# Altium schematic sheet NQX25017A-V1.0(i300-N32WB031).SchDoc
size 580 x 359 mm; SheetNumber: 1; SheetTotal: 1
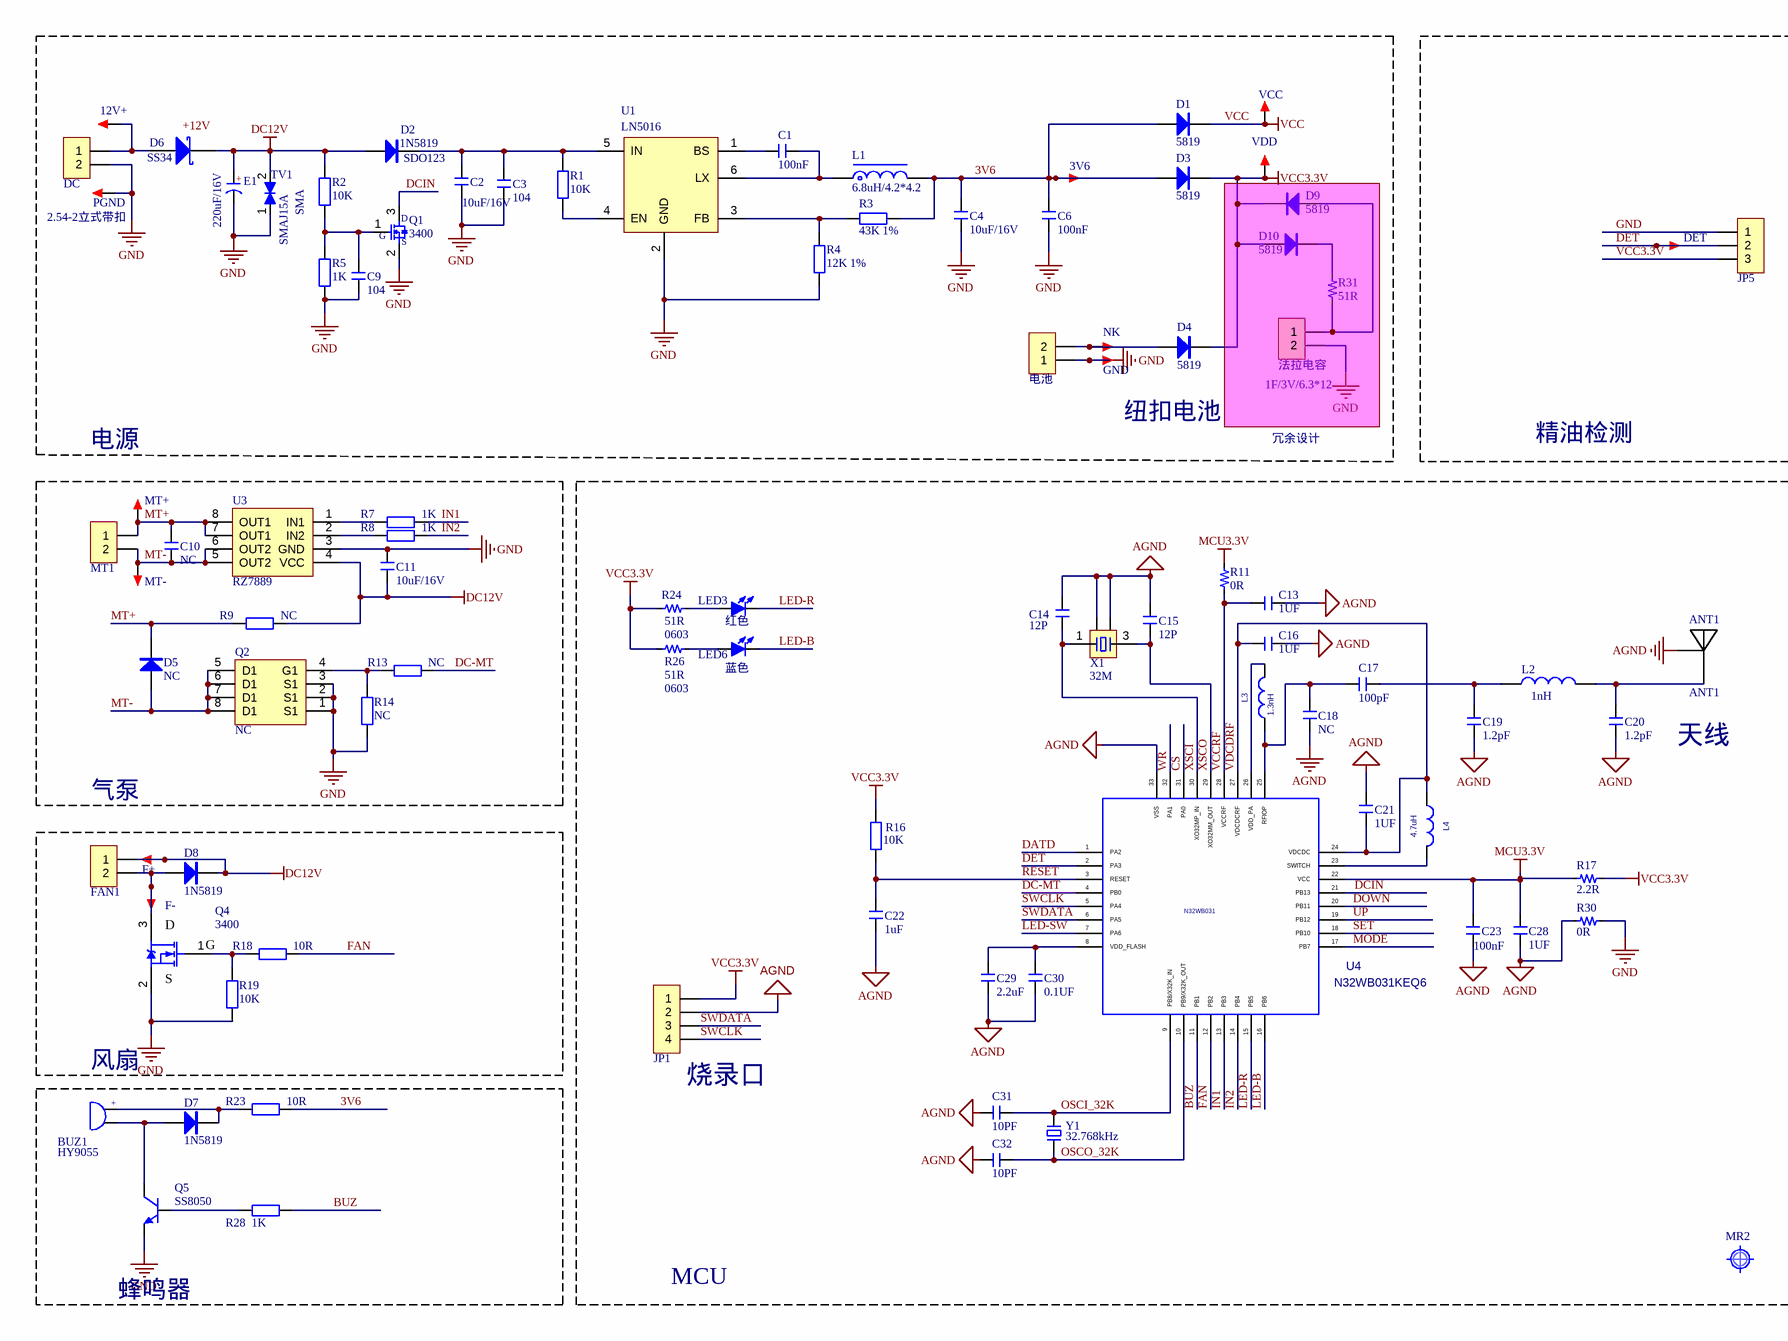
[diagram p0: NQX25017A-V1.0(i300-N32WB031).SchDoc, left]
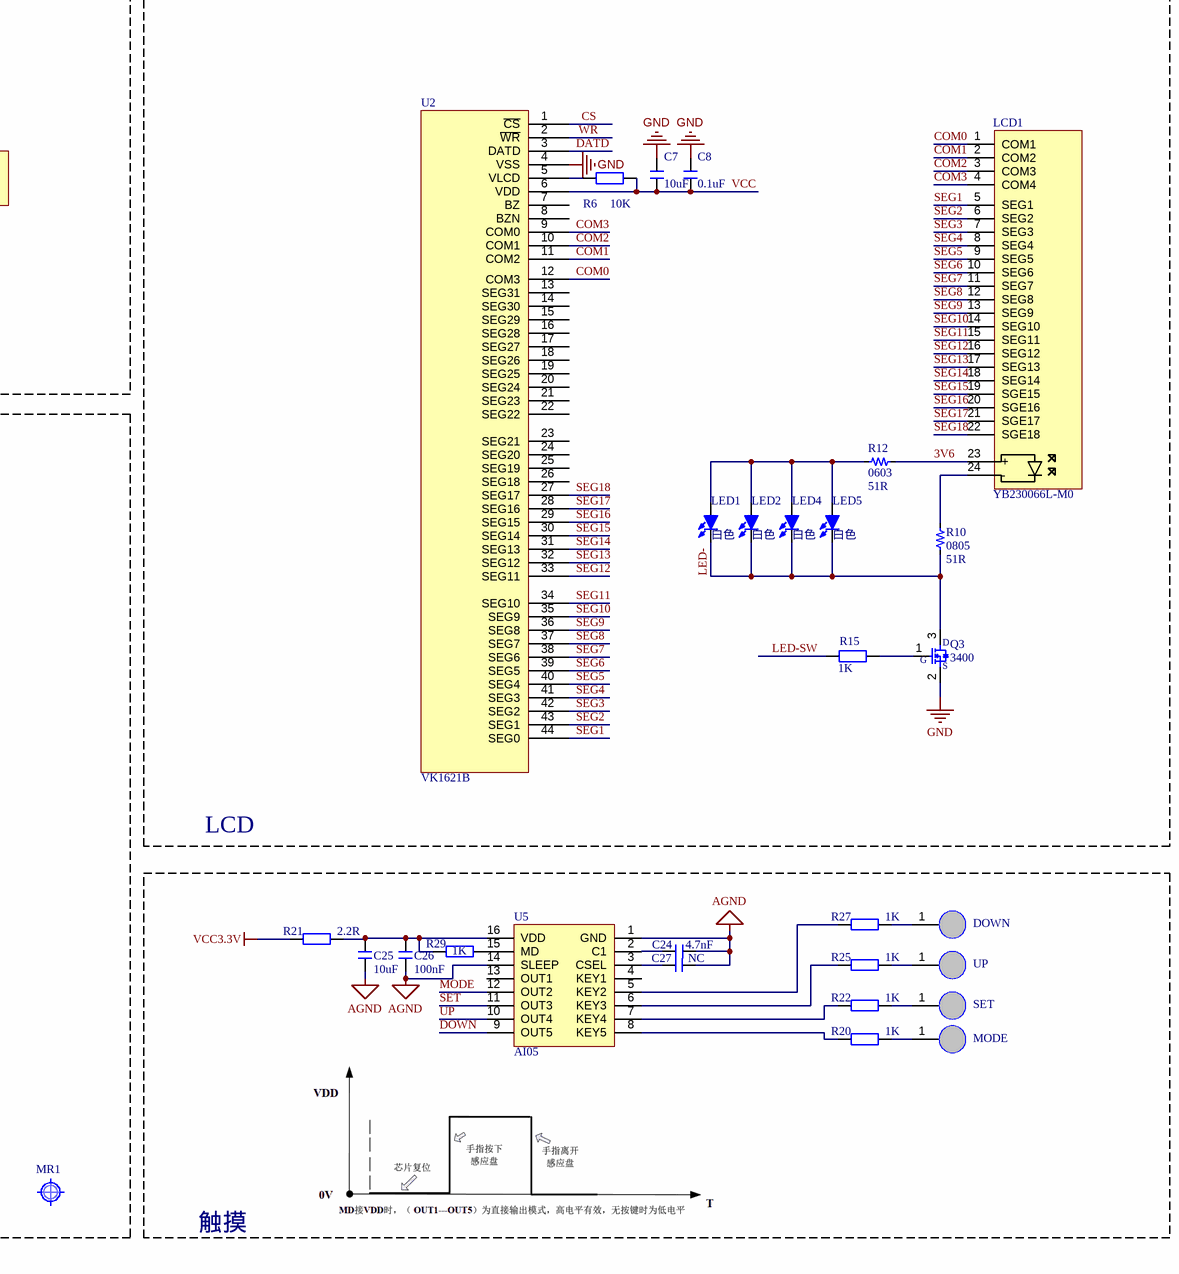
[diagram p1: NQX25017A-V1.0(i300-N32WB031).SchDoc, right]

## Parts
3V6  TEST  [TEST 1.2]  (value not drawn)
12V+  TEST  [TEST 1.2]  (value not drawn)
ANT1  ANT1  [ANT-BLUE]
BUZ1  HY9055  [BEEP 4x9x5.5 - duplicate]
C1  100nF  [C0603-T]
C2  10uF/16V  [C0603]
C3  104  [C0603-T]
C4  10uF/16V  [C0805-T]
C6  100nF  [C0603-T]
C7  10uF  [C0603-T]
C8  0.1uF  [C0603-T]
C9  104  [C0603-T]
C10  NC  [C0603-T]
C11  10uF/16V  [C0603]
C13  1UF  [C0603-T]
C14  12P  [C0603-T]
C15  12P  [C0603-T]
C16  1UF  [C0603-T]
C17  100pF  [C0603-T]
C18  NC  [C0603-T]
C19  1.2pF  [C0603-T]
C20  1.2pF  [C0603-T]
C21  1UF  [C0603-T]
C22  1uF  [C0603-T]
C23  100nF  [C0603-T]
C24  4.7nF  [C0603-T]
C25  10uF  [C0603-T]
C26  100nF  [C0603-T]
C27  NC  [C0603-T]
C28  1UF  [C0603-T]
C29  2.2uF  [C0603-T]
C30  0.1UF  [C0603-T]
C31  10PF  [C0603-T]
C32  10PF  [C0603-T]
D1  5819  [SOD-123]
D2  1N5819  value SDO123  [SOD-123]
D3  5819  [SOD-123]
D4  5819  [SOD-123]
D5  NC  [SMA]
D6  SS34  [SMA]
D7  1N5819  [MINI_MELF (LL34)]
D8  1N5819  [MINI_MELF (LL34)]
D9  5819  [SOD-123]
D10  5819  [SOD-123]
DC  2.54-2立式带扣  [XH2.54-LS-2P]
DET  TEST  [TEST 1.2]  (value not drawn)
DOWN  12x16  [0.3-6.8-12-8]  (value not drawn)
E1  220uF/16V  [CM D(6.3*7.7)]
F+  TEST  [TEST 1.2]  (value not drawn)
F-  TEST  [TEST 1.2]  (value not drawn)
FAN1  2.54-2立式带扣  [XH2.54-LS-2P]  (value not drawn)
GND  TEST  [TEST 1.2]  (value not drawn)
JP1  HDR-1X4  [CN4P2.0]  (value not drawn)
JP5  1.25X3立贴  [MX 1.25-LS-3P]  (value not drawn)
L1  6.8uH/4.2*4.2  [L5X5]
L2  1nH  [R0603-T]
L3  1.3nH  [R0603-T]
L4  4.7uH  [R0603-T]
LCD1  YB230066L-M0  [YB23006L0-M0]
LED1  白色  [LED 0805G]
LED2  白色  [LED 0805G]
LED3  红色  [LED 0805B]
LED4  白色  [LED 0805G]
LED5  白色  [LED 0805G]
LED6  蓝色  [LED 0805B]
MODE  12x16  [0.3-6.8-12-8]  (value not drawn)
MR1  (no value)  [Mark 1]
MR2  (no value)  [Mark 1]
MT1  2.54-2立式带扣  [XH2.54-LS-2P]  (value not drawn)
MT+  TEST  [TEST 1.2]  (value not drawn)
MT-  TEST  [TEST 1.2]  (value not drawn)
NK  TEST  [TEST 1.2]  (value not drawn)
PGND  TEST  [TEST 1.2]  (value not drawn)
Q1  3400  [SOT-23]
Q2  NC  [DFN3X3_8P]
Q3  3400  [SOT-23]
Q4  3400  [SOT-23]
Q5  SS8050  [SOT-23]
R1  10K  [R0603-T]
R2  10K  [R0603-T]
R3  43K 1%  [R0603-T]
R4  12K 1%  [R0603-T]
R5  1K  [R0603-T]
R6  10K  [R0603-T]
R7  1K  [R0603-T]
R8  1K  [R0603-T]
R9  NC  [R1206-T]
R10  51R  value 0805  [R0805-T]
R11  0R  [R0603-T]
R12  51R  value 0603  [R0603-T]
R13  NC  [R0603-T]
R14  NC  [R0603-T]
R15  1K  [R0603-T]
R16  10K  [R0603-T]
R17  2.2R  [R0603-T]
R18  10R  [R0603-T]
R19  10K  [R0603-T]
R20  1K  [R0603-T]
R21  2.2R  [R0603-T]
R22  1K  [R0603-T]
R23  10R  [R0603-T]
R24  51R  value 0603  [R0603-T]
R25  1K  [R0603-T]
R26  51R  value 0603  [R0603-T]
R27  1K  [R0603-T]
R28  1K  [R0603-T]
R29  1K  [R0603-T]
R30  0R  [R0603-T]
R31  51R  [R0805-T]
SET  12x16  [0.3-6.8-12-8]  (value not drawn)
TV1  SMAJ15A  value SMA  [SMA]
U1  LN5016  [SOT23-6L]
U2  VK1621B  [LQFP44 10X10_N]
U3  RZ7889  [SOP8_N]
U4  N32WB031KEQ6  value N32WB031  [QFN32_4X4]
U5  AI05  [SOP16]
UP  12x16  [0.3-6.8-12-8]  (value not drawn)
VCC  TEST  [TEST 1.2]  (value not drawn)
VDD  TEST  [TEST 1.2]  (value not drawn)
X1  32M  [OSC3225]
Y1  32.768kHz  [OSC-3x8-WI-B]
法拉电容  1F/3V/6.3*12  [CE-2.5*5*11-H]
电池  2.0-2立贴无扣  [PH2.0-LS-2P]  (value not drawn)

## Blocks framed on the sheet
精油检测: DET JP5
LCD: C7 C8 LCD1 LED1 LED2 LED4 LED5 Q3 R6 R10 R12 R15 U2
气泵: C10 C11 D5 MT1 MT+ MT- Q2 R7-R9 R13 R14 U3
风扇: D8 F+ F- FAN1 Q4 R18 R19
触摸: C24-C27 DOWN MODE R20-R22 R25 R27 R29 SET U5 UP

## Nets
AGND: ANT1.2 C13.1 C14.2 C15.2 C16.1 C18.1 C19.1 C20.1 C21.1 C22.1 C23.2 C24.2 C25.2 C26.2 C27.2 C28.2 C29.1 C30.2 C31.1 C32.1 JP1.2 R30.2 U4.33(VSS) U5.1(GND) U5.14(SLEEP) X1.2 X1.4
DC12V: C11.1 D2.1(A) D6.2(K) D8.2(K) E1.1(A) F+.1 FAN1.1 R2.1 R9.2 TV1.2(k) U3.4(VCC)
GND: C2.1 C3.1 C4.1 C6.2 C7.1 C8.1 C9.1 C11.2 DC.2 E1.2(K) GND.1 JP5.1 PGND.1 Q1.2(S) Q2.1(S1) Q2.2(S1) Q2.3(S1) Q3.2(S) Q4.2(S) Q5.2(E) R4.1 R5.1 R14.1 R19.1 R30.1 TV1.1(a) U1.2(GND) U2.4(VSS) U3.3(GND) 法拉电容.2 电池.1
MCU3.3V: C23.1 C28.1 R11.2 R17.2 U4.22(VCC)
VCC: C7.2 C8.2 D1.2(K) R6.1 U2.6(VDD) VCC.1
VCC3.3V: D3.2(K) D4.2(K) D9.2(K) D10.1(A) JP1.1 JP5.3 R16.1 R17.1 R21.1 R24.1 R26.1 VDD.1
3V6: 3V6.1 C4.2 C6.1 D1.1(A) D3.1(A) L1.2 LCD1.23(+) R3.2 R12.2 R23.2
BUZ: R28.1 U4.11(PB1)
COM0: LCD1.1(COM1) U2.12(COM3)
COM1: LCD1.2(COM2) U2.11(COM2)
COM2: LCD1.3(COM3) U2.10(COM1)
COM3: LCD1.4(COM4) U2.9(COM0)
CS: U2.1(~{CS}) U4.31(PA0)
DATD: U2.3(DATD) U4.1(PA2)
DC-MT: R13.2 U4.4(PB0)
DCIN: Q1.3(D) U4.21(PB13)
DET: DET.1 JP5.2 U4.2(PA3)
DOWN: U4.20(PB11) U5.9(OUT5)
FAN: R18.2 U4.12(PB2)
IN1: R7.2 U4.13(PB3)
IN2: R8.2 U4.14(PB4)
LED-: LED1.2(K) LED2.2(K) LED4.2(K) LED5.2(K) Q3.3(D) R10.1
LED-B: LED6.2(K) U4.16(PB6)
LED-R: LED3.2(K) U4.15(PB5)
LED-SW: R15.2 U4.7(PA6)
MODE: U4.17(PB7) U5.12(OUT2)
MT+: C10.2 D5.2(K) MT1.1 MT+.1 R9.1 U3.7(OUT1) U3.8(OUT1)
MT-: C10.1 D5.1(A) MT1.2 MT-.1 Q2.5(D1) Q2.6(D1) Q2.7(D1) Q2.8(D1) U3.5(OUT2) U3.6(OUT2)
OSCI_32K: C31.2 U4.9(PB8/X32K_IN) Y1.1
OSCO_32K: C32.2 U4.10(PB9/X32K_OUT) Y1.2
RESET: C22.2 R16.2 U4.3(RESET)
SEG1: LCD1.5(SEG1) U2.44(SEG0)
SEG2: LCD1.6(SEG2) U2.43(SEG1)
SEG3: LCD1.7(SEG3) U2.42(SEG2)
SEG4: LCD1.8(SEG4) U2.41(SEG3)
SEG5: LCD1.9(SEG5) U2.40(SEG4)
SEG6: LCD1.10(SEG6) U2.39(SEG5)
SEG7: LCD1.11(SEG7) U2.38(SEG6)
SEG8: LCD1.12(SEG8) U2.37(SEG7)
SEG9: LCD1.13(SEG9) U2.36(SEG8)
SEG10: LCD1.14(SEG10) U2.35(SEG9)
SEG11: LCD1.15(SEG11) U2.34(SEG10)
SEG12: LCD1.16(SEG12) U2.33(SEG11)
SEG13: LCD1.17(SEG13) U2.32(SEG12)
SEG14: LCD1.18(SEG14) U2.31(SEG13)
SEG15: LCD1.19(SGE15) U2.30(SEG14)
SEG16: LCD1.20(SGE16) U2.29(SEG15)
SEG17: LCD1.21(SGE17) U2.28(SEG16)
SEG18: LCD1.22(SGE18) U2.27(SEG17)
SET: U4.18(PB10) U5.11(OUT3)
SWCLK: JP1.4 U4.5(PA4)
SWDATA: JP1.3 U4.6(PA5)
UP: U4.19(PB12) U5.10(OUT4)
VCCRF: C13.2 R11.1 U4.28(VCCRF)
VDCDRF: C16.2 C21.2 L4.2 U4.24(VDCDC) U4.27(VDCDCRF)
WR: U2.2(~{WR}) U4.32(PA1)
XSCI: C14.1 U4.30(XO32MP_IN) X1.1
XSCO: C15.1 U4.29(XO32MM_OUT) X1.3
Net12V+_1: 12V+.1 D6.1(A) DC.1
NetANT1_1: ANT1.1 C20.2 L2.2
NetBUZ1_1: BUZ1.1 D7.2(K) R23.1
NetBUZ1_2: BUZ1.2 D7.1(A) Q5.3(C)
NetC1_1: C1.1 L1.1 U1.6(LX)
NetC1_2: C1.2 U1.1(BS)
NetC2_2: C2.2 C3.2 D2.2(K) R1.1 U1.5(IN)
NetC9_2: C9.2 Q1.1(G) R2.2 R5.2
NetC17_1: C17.1 C19.2 L2.1
NetC17_2: C17.2 C18.2 L3.2 U4.25(RFIOP)
NetC24_1: C24.1 U5.2(C1)
NetC25_1: C25.1 C26.1 R21.2 R29.1 U5.16(VDD)
NetC27_1: C27.1 U5.3(CSEL)
NetC29_2: C29.2 C30.1 U4.8(VDD_FLASH)
NetD4_1: D4.1(A) NK.1 电池.2
NetD8_1: D8.1(A) F-.1 FAN1.2 Q4.3(D)
NetD9_1: D9.1(A) R31.1 法拉电容.1
NetD10_2: D10.2(K) R31.2
NetDOWN_1: DOWN.1 R27.2
NetL3_1: L3.1 U4.26(VDD_PA)
NetL4_1: L4.1 U4.23(SWITCH)
NetLCD1_24: LCD1.24(-) R10.2
NetLED1_1: LED1.1(A) LED2.1(A) LED4.1(A) LED5.1(A) R12.1
NetLED3_1: LED3.1(A) R24.2
NetLED6_1: LED6.1(A) R26.2
NetMODE_1: MODE.1 R20.2
NetQ2_4: Q2.4(G1) R13.1 R14.2
NetQ3_1: Q3.1(G) R15.1
NetQ4_1: Q4.1(G) R18.1 R19.2
NetQ5_1: Q5.1(B) R28.2
NetR1_2: R1.2 U1.4(EN)
NetR3_1: R3.1 R4.2 U1.3(FB)
NetR6_2: R6.2 U2.5(VLCD)
NetR7_1: R7.1 U3.1(IN1)
NetR8_1: R8.1 U3.2(IN2)
NetR20_1: R20.1 U5.8(KEY5)
NetR22_1: R22.1 U5.7(KEY4)
NetR22_2: R22.2 SET.1
NetR25_1: R25.1 U5.6(KEY3)
NetR25_2: R25.2 UP.1
NetR27_1: R27.1 U5.5(KEY2)
NetR29_2: R29.2 U5.15(MD)

Not connected (* = marked no-connect by the designer): U2 7(BZ) 8(BZN) 13(SEG31) 14(SEG30) 15(SEG29) 16(SEG28) 17(SEG27) 18(SEG26) 19(SEG25) 20(SEG24) 21(SEG23) 22(SEG22) 23(SEG21) 24(SEG20) 25(SEG19) 26(SEG18); U5 4(KEY1) 13(OUT1)

## Notes on the sheet
- 电源
- 纽扣电池
- 冗余设计
- 天线
- (near JP1) 烧录口
- 蜂鸣器
- MCU
- Labels drawn without touching a wire or pin: +12V
- DWG NO:
- REV:
- THIS DOCUMENT AND THE DATA DISCLOSED HEREIN OR
- HEREWITH IS THE PROPERTY OF ALTIUM LIMITED AND MAY
- BE FREELY DISTRIBUTED IN WHOLE. NO RIGHTS ARE
- RESERVED OR EXPRESS OR IMPLIED WARANTEE GIVEN.
- REVISION
- DESCRIPTION
- DATE
- APPROVED
- ENG:
- APPROVALS
- PROJECT
- DSN:
- CHK:
- REFERENCE DOCUMENTS
- PROJECT REVISION:
- TITLE
- DOCUMENT REVISION:
- DESIGN ITEM:
- BOM:
- FAB DWG:
- PCB DWG:
- ASSY DWG:
- SCALE:
- A2
- SIZE
- CAGE CODE
- FILE NAME
- DWG NO.
- SHEET
- OF
- REV
- (in symbol BEEP) +
- (in symbol CE_SMD) +

## Library data of the parts
3V6 12V+ DET F+ F- GND MT+ MT- NK PGND VCC VDD = TEST: 测试点; 版权归属: 封装库来自淘宝 ID：黄晶宝石; BOM名称: 测试点; 学习资源: https://shop463601444.taobao.com
ANT1 = ANT2_1: PCB板载天线; 版权归属: 封装库来自淘宝 ID：黄晶宝石; BOM名称: PCB板载天线; 技术支持，联系售后: https://shop463601444.taobao.com
BUZ1 = BEEP: 蜂鸣器; 版权归属: 封装库来自淘宝 ID：黄晶宝石; BOM名称: 蜂鸣器; 技术支持，联系售后: https://shop463601444.taobao.com
C1-C4 C6 C9-C11 C17-C20 C22 C24-C27 C29 C31 C32 = C: 贴片电容; BOM名称: 无极性贴片电容; 淘宝ID: 封装库来自淘宝 ID：黄晶宝石; 联系售后，技术支持: https://shop463601444.taobao.com; 唯一出售店铺网址: https://shop463601444.taobao.com
C7 C8 C13-C16 C21 C23 C28 C30 = C: 贴片电容; 唯一出售店铺网址: https://shop463601444.taobao.com
D1-D4 D9 D10 = 1N4007: 整流二极管; 淘宝ID: 封装库来自淘宝 ID：黄晶宝石; 封装库来自淘宝卖家 ID：黄晶宝石: 其他店铺购入均为盗版，不享受售后技术支持服务，请立即申请退款; 联系售后，技术支持: https://shop463601444.taobao.com
  D1 D3 D4 D9 D10: BOM名称: 整流二极管
D5 = M7: 整流二极管; 版权归属: 封装库来自淘宝 ID：黄晶宝石; BOM名称: 整流二极管; 学习资源: https://shop463601444.taobao.com
D6 = SS14: 肖特基二极管; 属性: 40V/1A; BOM名称: 肖特基二极管; 封装库来自淘宝 ID：黄晶宝石: https://shop463601444.taobao.com
D7 D8 = 1N4148: 开关二极管; BOM名称: 高速开关二极管; 淘宝ID: 封装库来自淘宝 ID：黄晶宝石; 欢迎光临: https://shop463601444.taobao.com
DC FAN1 MT1 法拉电容 电池 = Header 2: 2P接插件; 版权归属: 封装库来自淘宝 ID：黄晶宝石; BOM名称: 2P接插件
  DC FAN1 MT1: 联系售后: https://shop463601444.taobao.com
  法拉电容 电池: 技术支持，联系售后: https://shop463601444.taobao.com
DOWN MODE SET UP = TTS: 触控弹簧; 版权归属: 封装库来自淘宝 ID：黄晶宝石; BOM名称: 触控弹簧; 技术支持，联系售后: https://shop463601444.taobao.com
E1 = CE_SMD: 贴片电解电容; 版权归属: 封装库来自淘宝 ID：黄晶宝石; BOM名称: 贴片电解电容; 联系售后: https://shop463601444.taobao.com
JP1 = Header 4: 学习资源: https://shop463601444.taobao.com
JP5 = Header 3: 3P接插件; 联系售后: 封装库来自淘宝 ID：黄晶宝石; BOM名称: 3P接插件; 学习资源: https://shop463601444.taobao.com
L1 = L-SMD: CD系列贴片线绕功率电感; BOM名称: 功率电感; 淘宝ID: 封装库来自淘宝 ID：黄晶宝石; 学习资源: www.ooocke.com
L2 = L: 小功率贴片电感; 淘宝ID: 封装库来自淘宝 ID：黄晶宝石; 封装库来自淘宝卖家 ID：黄晶宝石: 其他店铺购入均为盗版，不享受售后技术支持服务，请立即申请退款; BOM名称: 小功率贴片电感; 联系售后: https://shop463601444.taobao.com
L3 L4 = INDUCTOR_0402: MOLDED INDUCTOR, 0.5" PIN SPACING; Sim.Analog.Order: Model$; Sim.Analog.Prefix: L; PCB DECAL: RF0402
  L3: Value: 1.3nH
LCD1 = YB230066L-M0: YB230066L-M0-22PIN
LED1-LED6 = LED-SMD: 贴片LED; 版权归属: 封装库来自淘宝 ID：黄晶宝石; BOM名称: 贴片LED; 学习资源: https://shop463601444.taobao.com
MR1 MR2 = MARK: 光学定位点; 版权归属: 封装库来自淘宝 ID：黄晶宝石; BOM名称: 光学定位点; 学习资源: https://shop463601444.taobao.com
Q1 Q3 = QMOS-N: Value: ?
Q2 = WSD3050DN: WSD3050DN NMOS
Q4 = SI2302: N沟道场效应管; 技术支持，联系售后: 封装库来自淘宝 ID：黄晶宝石; BOM名称: N沟道场效应管; 学习资源: https://shop463601444.taobao.com
Q5 = 8050-SMD: 高频放大-NPN型; 版权归属: 封装库来自淘宝 ID：黄晶宝石; 属性: 40V 1.5A 1W 100MHZ; BOM名称: 高频放大-NPN型; 联系售后: https://shop463601444.taobao.com
R1-R5 R7-R9 R13-R16 R18-R23 R25 R27-R29 = R: 贴片电阻; 版权归属: 来自淘宝 ID：黄晶宝石; 封装库来自淘宝卖家 ID：黄晶宝石: 其他店铺购入均为盗版，不享受售后技术支持服务，请立即申请退款; BOM名称: 贴片电阻; 联系售后: https://shop463601444.taobao.com
R6 = R: 贴片电阻; BOM名称: 贴片电阻; 联系售后: https://shop463601444.taobao.com
R10 = R0805185-51R: 贴片电阻/51R/±5%/0805/1/8W
R11 R17 R30 R31 = Res: Value: ?
R12 R24 R26 = R0603101-51R: 贴片电阻/51R/±1%/0603/1/10W
TV1 = D-TVS-0402
U1 = LN5016: 降压IC,LN5016,SOT23-6 环保
U2 = VK1621B: VK1621B 32*4 液晶驅動 IC
U3 = SS6285L: DC 双向马达驱动电路
U4 = NS7300_1A_QFN32: PCB DECAL: QFN32_4X4MM
U5 = AI05: AI05 5 键的电容式触摸感应芯片
X1 = XTAL-4P: 4脚无源晶振(谐振器）; 联系下单店铺卖家 免费帮你查找封装: 联系下单店铺卖家 免费技术支持; BOM名称: 4脚无源晶振(谐振器）
Y1 = XTAL-2P: 2脚无源脚晶振; 版权归属: 封装库来自淘宝卖家 ID：黄晶宝石; BOM名称: 2脚无源脚晶振; 学习资源: https://shop463601444.taobao.com